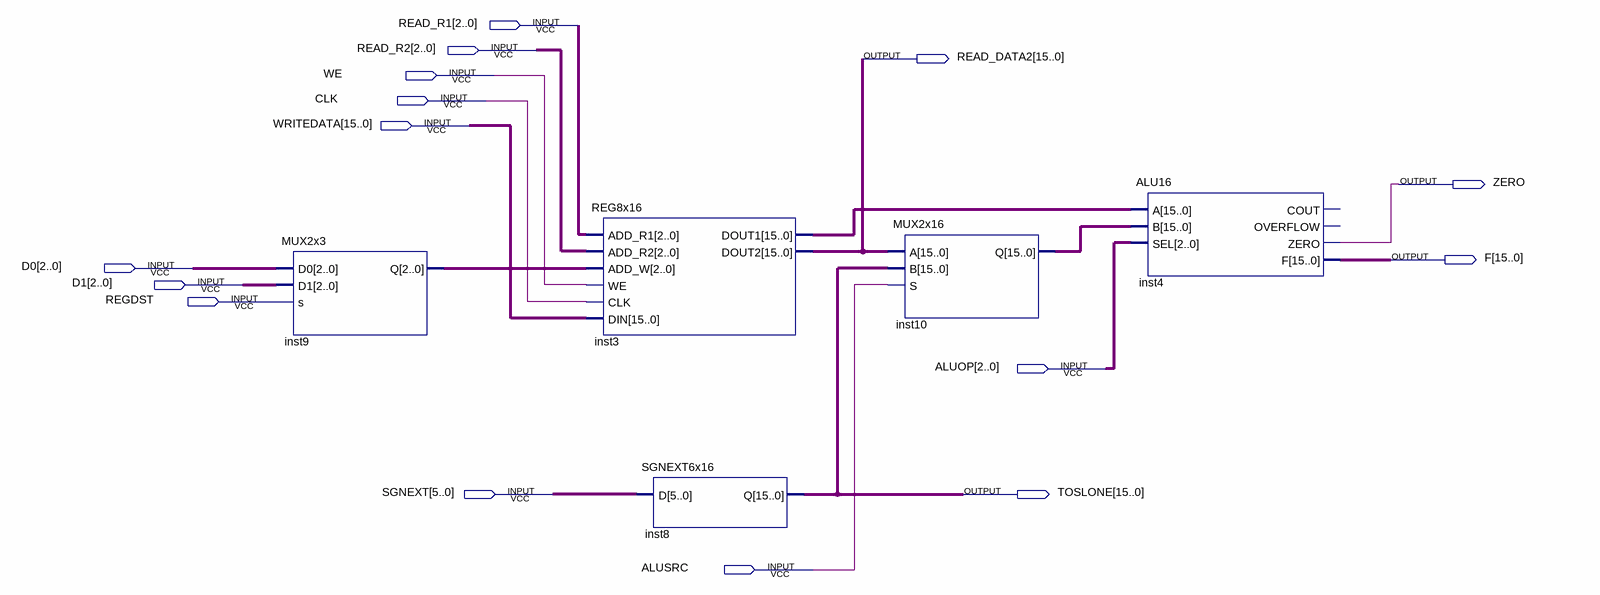
[diagram p0: schematic sheet]
// Quartus schematic Center.bdf as structural Verilog: 5 symbols, 15 pins
module Center (
  input  [2:0] READ_R1,
  input  [2:0] READ_R2,
  input  WE,
  input  CLK,
  input  [15:0] WRITEDATA,
  input  [2:0] D0,
  input  [2:0] D1,
  input  REGDST,
  input  [2:0] ALUOP,
  input  [5:0] SGNEXT,
  input  ALUSRC,
  output [15:0] READ_DATA2,
  output ZERO,
  output [15:0] F,
  output [15:0] TOSLONE
);

  wire [2:0] inst9_q;
  wire [15:0] inst3_dout1, inst10_q;

  MUX2x3 inst9 (.D0(D0), .D1(D1), .s(REGDST), .Q(inst9_q));
  REG8x16 inst3 (
    .ADD_R1(READ_R1), .ADD_R2(READ_R2), .ADD_W(inst9_q), .WE(WE), .CLK(CLK), .DIN(WRITEDATA),
    .DOUT1(inst3_dout1), .DOUT2(READ_DATA2));
  SGNEXT6x16 inst8 (.D(SGNEXT), .Q(TOSLONE));
  MUX2x16 inst10 (.A(READ_DATA2), .B(TOSLONE), .S(ALUSRC), .Q(inst10_q));
  ALU16 inst4 (.A(inst3_dout1), .B(inst10_q), .SEL(ALUOP), .ZERO(ZERO), .F(F));  // open: COUT, OVERFLOW
endmodule
